# Altium schematic sheet TDC_cern.SchDoc: FMC_ADC
size 420 x 297 mm; Author: G.Kasprowicz; CompanyName: WUT ISE; DrawnBy: G.Kasprowicz; Organization: WUT ISE; Address1: PW ISE; Address2: Nowowiejska 15/19 00-665 Warsaw; Address3: gkasprow@gmail.com; DocumentNumber: 4; Revision: 2; SheetNumber: 4; SheetTotal: 12; ModifiedBy: -; CheckedDate: -; Title2: quad TDC; DivGrp: WUT ISE; Designer: G.Kasprowicz; ModifiedDate: -; ProjectName: Sensor Box
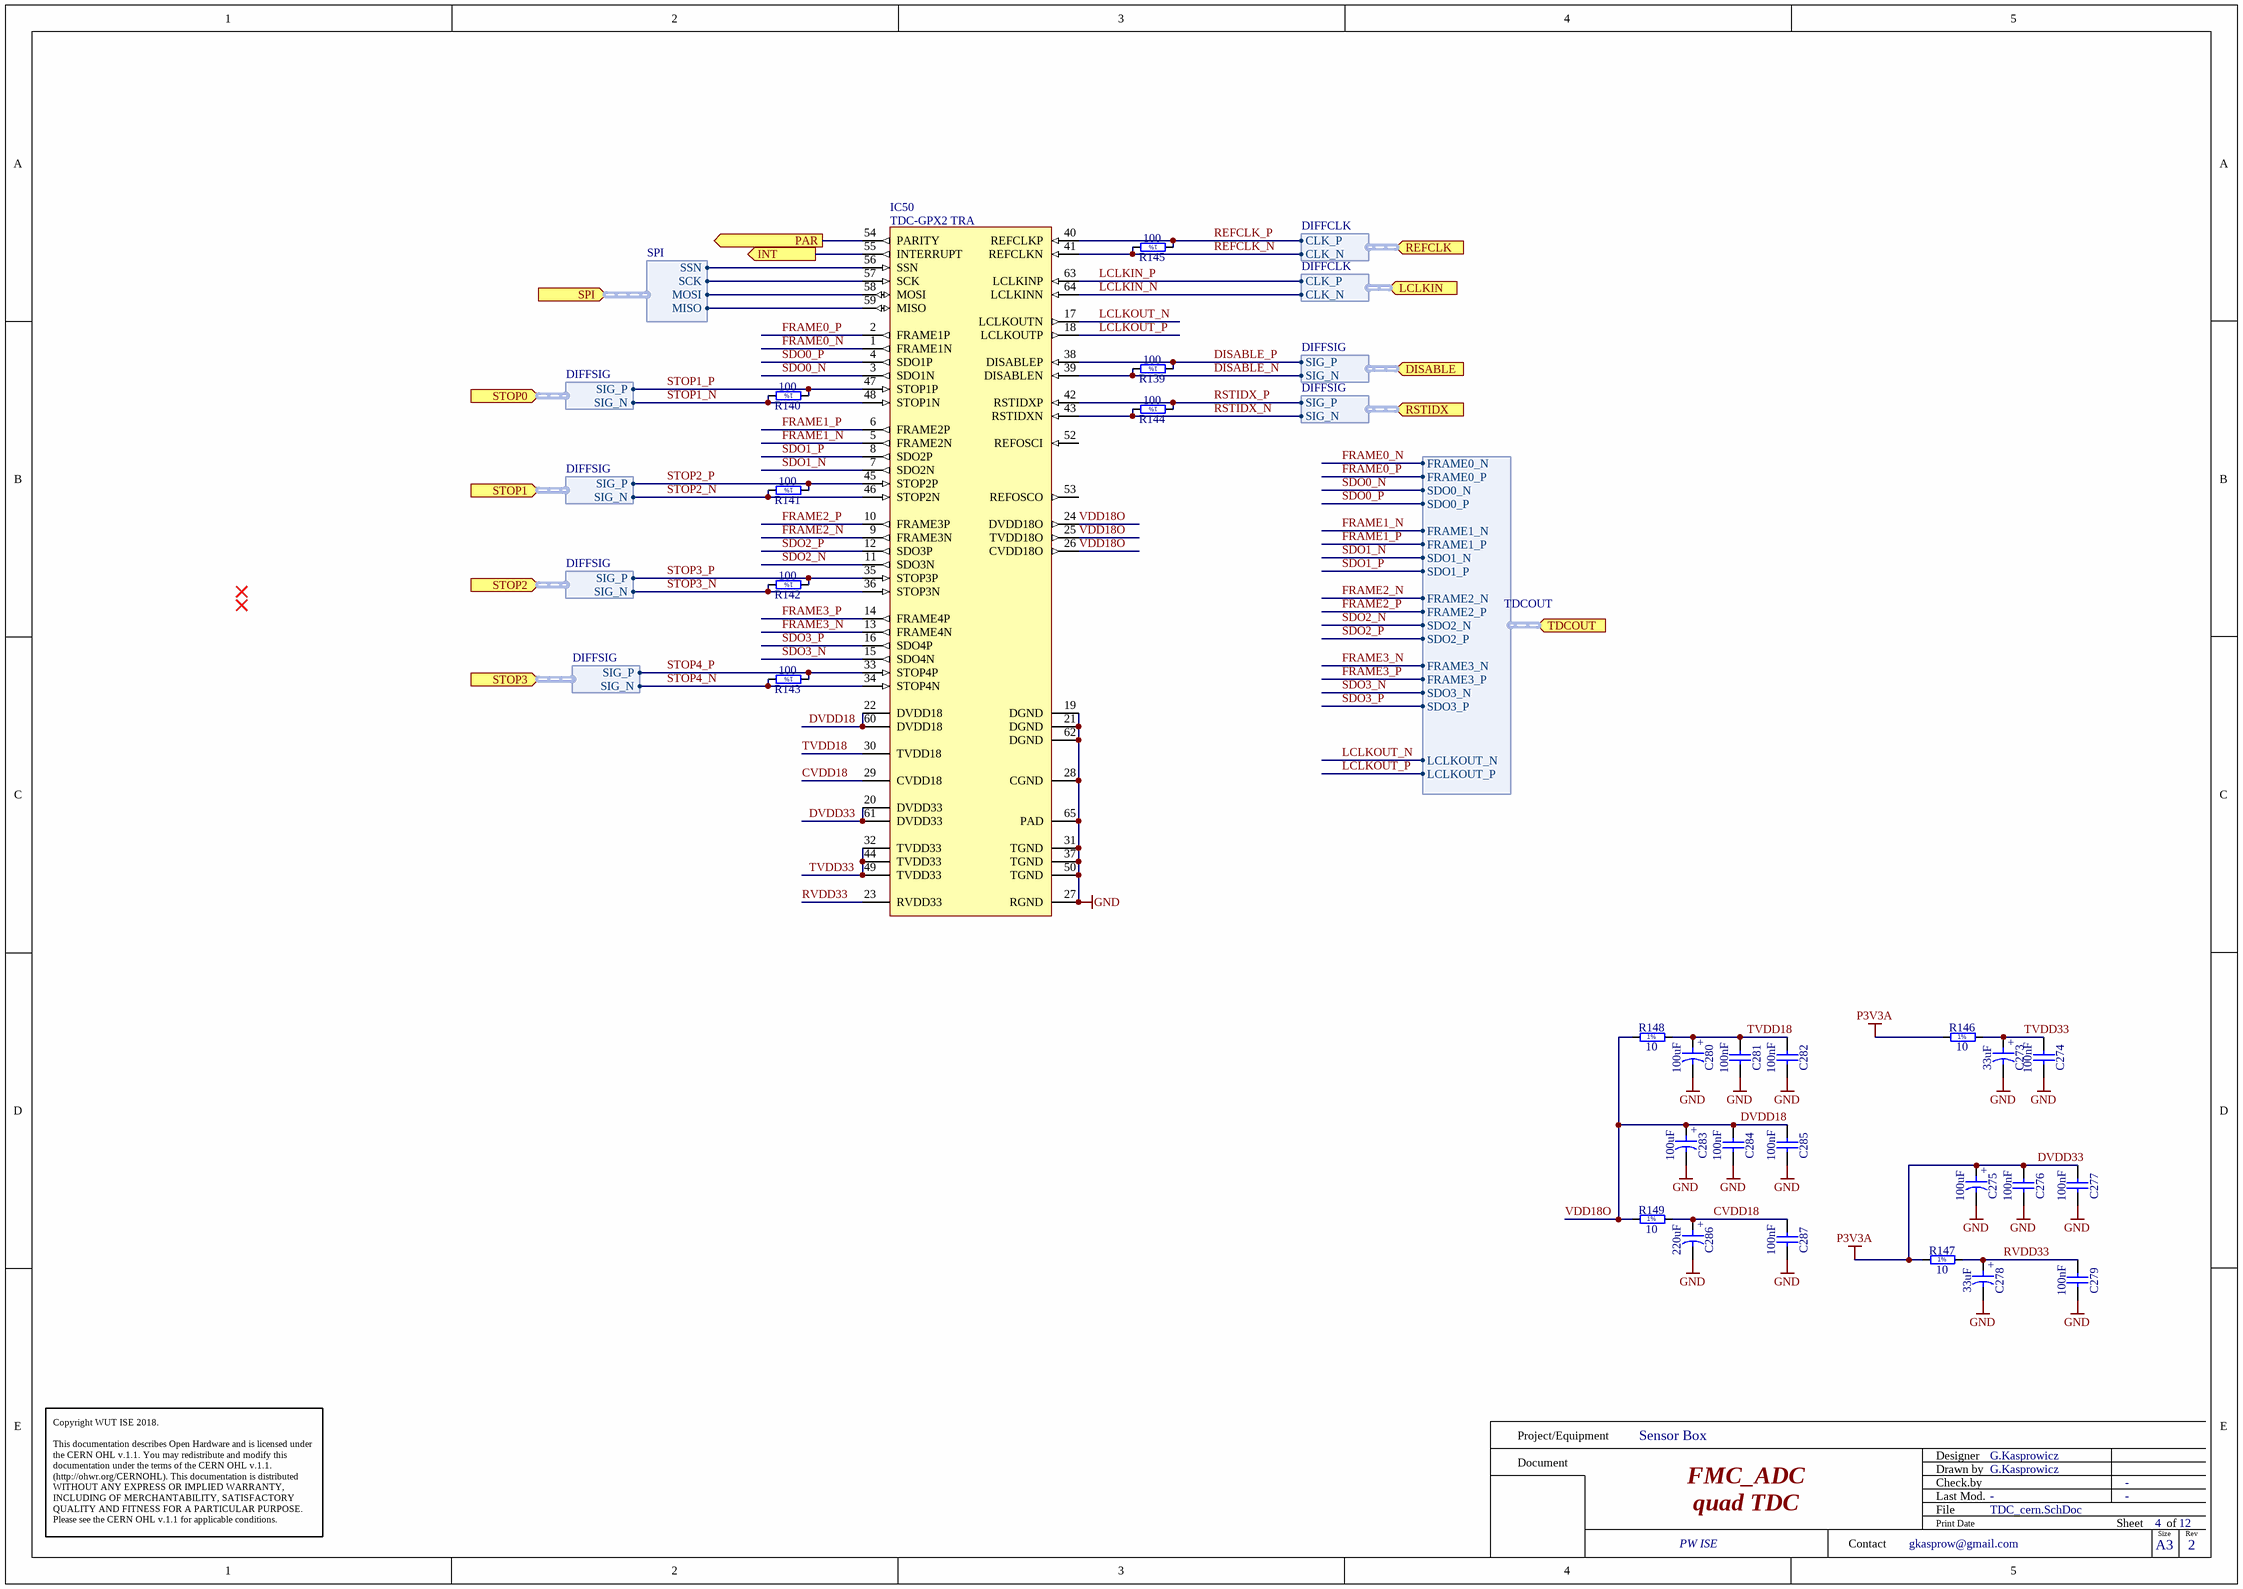
[diagram p0: TDC_cern.SchDoc]

## Parts
C273  33uF  [CAPMP3216X180N]
C274  100nF  [CAPC0603X33N]
C275  100uF  [CAPMP3216X180N]
C276  100nF  [CAPC0603X33N]
C277  100nF  [CAPC0603X33N]
C278  33uF  [CAPMP3216X180N]
C279  100nF  [CAPC0603X33N]
C280  100uF  [CAPMP3216X180N]
C281  100nF  [CAPC0603X33N]
C282  100nF  [CAPC0603X33N]
C283  100uF  [CAPMP3216X180N]
C284  100nF  [CAPC0603X33N]
C285  100nF  [CAPC0603X33N]
C286  220uF  [CAPMP3528X210N]
C287  100nF  [CAPC0603X33N]
IC50  TDC-GPX2 TRA  [QFN50P900X900X100-65N-S615]
R139  100  [RESC0603X28N]
R140  100  [RESC0603X28N]
R141  100  [RESC0603X28N]
R142  100  [RESC0603X28N]
R143  100  [RESC0603X28N]
R144  100  [RESC0603X28N]
R145  100  [RESC0603X28N]
R146  10  [RESC1005X40N]
R147  10  [RESC1005X40N]
R148  10  [RESC1005X40N]
R149  10  [RESC1005X40N]

## Ports
DISABLE (in, harness DIFFSIG), INT (out), LCLKIN (in, harness DIFFCLK), PAR (out), REFCLK (in, harness DIFFCLK), RSTIDX (in, harness DIFFSIG), SPI (in, harness SPI), STOP0 (in, harness DIFFSIG), STOP1 (in, harness DIFFSIG), STOP2 (in, harness DIFFSIG), STOP3 (in, harness DIFFSIG), TDCOUT (in, harness TDCOUT)

## Harnesses
TDCOUT: FRAME0_N, FRAME0_P, SDO0_N, SDO0_P, FRAME1_N, FRAME1_P, SDO1_N, SDO1_P, FRAME2_N, FRAME2_P, SDO2_N, SDO2_P, FRAME3_N, FRAME3_P, SDO3_N, SDO3_P, LCLKOUT_N, LCLKOUT_P
SPI: MISO, MOSI, SCK, SSN
DIFFSIG: SIG_P, SIG_N
DIFFCLK: CLK_P, CLK_N

## Nets
DVDD33: C275.1 C276.1 C277.1 IC50.20(DVDD33) IC50.61(DVDD33) R146.1 R147.1  [also labelled P3V3A]
GND: C273.2 C274.2 C275.2 C276.2 C277.2 C278.2 C279.2 C280.2 C281.2 C282.2 C283.2 C284.2 C285.2 C286.2 C287.2 IC50.19(DGND) IC50.21(DGND) IC50.27(RGND) IC50.28(CGND) IC50.31(TGND) IC50.37(TGND) IC50.50(TGND) IC50.62(DGND) IC50.65(PAD)
CVDD18: C286.1 C287.1 IC50.29(CVDD18) R149.2
DISABLE_N: IC50.39(DISABLEN) R139.2 ; port DISABLE.SIG_N
DISABLE_P: IC50.38(DISABLEP) R139.1 ; port DISABLE.SIG_P
DVDD18: C283.1 C284.1 C285.1 IC50.22(DVDD18) IC50.24(DVDD18O) IC50.25(TVDD18O) IC50.26(CVDD18O) IC50.60(DVDD18) R148.1 R149.1  [also labelled VDD18O]
FRAME0_N: IC50.1(FRAME1N) ; port TDCOUT.FRAME0_N
FRAME0_P: IC50.2(FRAME1P) ; port TDCOUT.FRAME0_P
FRAME1_N: IC50.5(FRAME2N) ; port TDCOUT.FRAME1_N
FRAME1_P: IC50.6(FRAME2P) ; port TDCOUT.FRAME1_P
FRAME2_N: IC50.9(FRAME3N) ; port TDCOUT.FRAME2_N
FRAME2_P: IC50.10(FRAME3P) ; port TDCOUT.FRAME2_P
FRAME3_N: IC50.13(FRAME4N) ; port TDCOUT.FRAME3_N
FRAME3_P: IC50.14(FRAME4P) ; port TDCOUT.FRAME3_P
INT: IC50.55(INTERRUPT) ; port INT
LCLKIN_N: IC50.64(LCLKINN) ; port LCLKIN.CLK_N
LCLKIN_P: IC50.63(LCLKINP) ; port LCLKIN.CLK_P
LCLKOUT_N: IC50.17(LCLKOUTN) ; port TDCOUT.LCLKOUT_N
LCLKOUT_P: IC50.18(LCLKOUTP) ; port TDCOUT.LCLKOUT_P
PAR: IC50.54(PARITY) ; port PAR
REFCLK_N: IC50.41(REFCLKN) R145.2 ; port REFCLK.CLK_N
REFCLK_P: IC50.40(REFCLKP) R145.1 ; port REFCLK.CLK_P
RSTIDX_N: IC50.43(RSTIDXN) R144.2 ; port RSTIDX.SIG_N
RSTIDX_P: IC50.42(RSTIDXP) R144.1 ; port RSTIDX.SIG_P
RVDD33: C278.1 C279.1 IC50.23(RVDD33) R147.2
SDO0_N: IC50.3(SDO1N) ; port TDCOUT.SDO0_N
SDO0_P: IC50.4(SDO1P) ; port TDCOUT.SDO0_P
SDO1_N: IC50.7(SDO2N) ; port TDCOUT.SDO1_N
SDO1_P: IC50.8(SDO2P) ; port TDCOUT.SDO1_P
SDO2_N: IC50.11(SDO3N) ; port TDCOUT.SDO2_N
SDO2_P: IC50.12(SDO3P) ; port TDCOUT.SDO2_P
SDO3_N: IC50.15(SDO4N) ; port TDCOUT.SDO3_N
SDO3_P: IC50.16(SDO4P) ; port TDCOUT.SDO3_P
STOP1_N: IC50.48(STOP1N) R140.2 ; port STOP0.SIG_N
STOP1_P: IC50.47(STOP1P) R140.1 ; port STOP0.SIG_P
STOP2_N: IC50.46(STOP2N) R141.2 ; port STOP1.SIG_N
STOP2_P: IC50.45(STOP2P) R141.1 ; port STOP1.SIG_P
STOP3_N: IC50.36(STOP3N) R142.2 ; port STOP2.SIG_N
STOP3_P: IC50.35(STOP3P) R142.1 ; port STOP2.SIG_P
STOP4_N: IC50.34(STOP4N) R143.2 ; port STOP3.SIG_N
STOP4_P: IC50.33(STOP4P) R143.1 ; port STOP3.SIG_P
TVDD18: C280.1 C281.1 C282.1 IC50.30(TVDD18) R148.2
TVDD33: C273.1 C274.1 IC50.32(TVDD33) IC50.44(TVDD33) IC50.49(TVDD33) R146.2
NetIC50_56: IC50.56(SSN) ; port SPI.SSN
NetIC50_57: IC50.57(SCK) ; port SPI.SCK
NetIC50_58: IC50.58(MOSI) ; port SPI.MOSI
NetIC50_59: IC50.59(MISO) ; port SPI.MISO

Not connected (* = marked no-connect by the designer): IC50 52(REFOSCI) 53(REFOSCO)

## Notes on the sheet
- Project/Equipment
- Document
- Designer
- Drawn by
- Check.by
- Copyright WUT ISE 2018.
  This documentation describes Open Hardware and is licensed under the CERN OHL v.1.1. You may redistribute and modify this documentation under the terms of the CERN OHL v.1.1. (http://ohwr.org/CERNOHL). This documentation is distributed WITHOUT ANY EXPRESS OR IMPLIED WARRANTY, INCLUDING OF MERCHANTABILITY, SATISFACTORY QUALITY AND FITNESS FOR A PARTICULAR PURPOSE. Please see the CERN OHL v.1.1 for applicable conditions.
- Contact
- File
- Last Mod.
- Print Date
- Sheet
- Size
- A3
- of
- Rev
- (in symbol CTE3216-18_33UF_4V_10%) +
- (in symbol CTE3216-18_100UF_6.3V_20%_ESR0500_AVX_TLJ) +
- (in symbol CTE3528-21_220UF_2.5V_10%) +
- (in symbol R0201_100R_1%_0.05W_200PPM) 1%
- (in symbol R0402_10R_1%_0.0625W_200PPM) 1%

## Library data of the parts
C273 C278 = CTE3216-18_33UF_4V_10%: Polarised capacitor; Part Description: Solid Tantalum Chip Capacitor; Manufacturer: GENERIC; Manufacturer1 Part Number: TAJA336K004R; Voltage: 4V; Tolerance: ±10%; Part Number: CTE3216-18_33UF_4V_10%; Component Kind: Standard; Component Type: Standard; Pin Count: 2; Value: 33uF; Status: Preferred; Manufacturer Part Number: CTE3216-18_33UF_4V_10%; Case: A; Mounted: Yes; Socket: No; SMD: Yes; Sense: No; Manufacturer1 Example: AVX; Manufacturer1 ComponentHeight: 1.8mm; HelpURL: \\cern.ch\dfs\Applications\Altium\Datasheets\CTE_AVX_TAJ.pdf; Author: CERN DEM JLC; CreateDate: 03.12.2007; LatestRevisionDate: 03.12.2007
C274 C276 C279 C281 C282 C284 C287 = CC0201_100NF_6.3V_10%_X5R: Non-polarised capacitor; Part Description: SMD Multilayer Chip Ceramic Capacitor; Manufacturer: GENERIC; Manufacturer1 Part Number: 02016D104KAT2A; Voltage: 6.3V; TC: X5R; Tolerance: ±10%; Part Number: CC0201_100NF_6.3V_10%_X5R; Component Kind: Standard; Component Type: Standard; Pin Count: 2; Value: 100nF; Status: Not Recommended; Manufacturer Part Number: CC0201_100NF_6.3V_10%_X5R; Case: 0201; Mounted: Yes; Socket: No; SMD: Yes; Sense: No; Manufacturer1 Example: AVX; Manufacturer1 ComponentHeight: 0.33mm; HelpURL: \\cern.ch\dfs\Applications\Altium\Datasheets\CC0201_X5R_AVX.pdf; Author: CERN DEM JLC; CreateDate: 03.12.2007; LatestRevisionDate: 03.12.2007
C275 C280 C283 = CTE3216-18_100UF_6.3V_20%_ESR0500_AVX_TLJ: Polarised capacitor; Part Description: ESR 0R5 Solid Tantalum Chip Capacitor; Manufacturer: AVX; Manufacturer Part Number: TLJA107M006R0500; Voltage: 6.3V; Tolerance: ±20%; Part Number: CTE3216-18_100UF_6.3V_20%_ESR0500_AVX_TLJ; Component Kind: Standard; Component Type: Standard; Pin Count: 2; Value: 100uF; Status: None; Case: A; Mounted: Yes; Socket: No; SMD: Yes; Sense: No; HelpURL: \\cern.ch\dfs\Applications\Altium\Datasheets\CTE_AVX_TLJ.pdf; Author: CERN DEM JLC; CreateDate: 19.12.2013; LatestRevisionDate: 19.12.2013; ComponentHeight: 1.8mm
C277 C285 = CC0201_100NF_6.3V_10%_X5R: Non-polarised capacitor; Part Description: SMD Multilayer Chip Ceramic Capacitor; Manufacturer: GENERIC; Manufacturer1 Part Number: 02016D104KAT2A; Voltage: 6.3V; Tolerance: ±10%; TC: X5R; Part Number: CC0201_100NF_6.3V_10%_X5R; Component Kind: Standard; Component Type: Standard; Pin Count: 2; Value: 100nF; Status: Not Recommended; Manufacturer Part Number: CC0201_100NF_6.3V_10%_X5R; Case: 0201; Mounted: Yes; Socket: No; SMD: Yes; Sense: No; Manufacturer1 Example: AVX; Manufacturer1 ComponentHeight: 0.33mm; HelpURL: \\cern.ch\dfs\Applications\Altium\Datasheets\CC0201_X5R_AVX.pdf; Author: CERN DEM JLC; CreateDate: 03.12.2007; LatestRevisionDate: 03.12.2007
C286 = CTE3528-21_220UF_2.5V_10%: Polarised capacitor; Part Description: Solid Tantalum Chip Capacitor; Manufacturer: GENERIC; Manufacturer1 Part Number: TAJB227K002R; Voltage: 2.5V; Tolerance: ±10%; Part Number: CTE3528-21_220UF_2.5V_10%; Component Kind: Standard; Component Type: Standard; Pin Count: 2; Value: 220uF; Status: Preferred; Manufacturer Part Number: CTE3528-21_220UF_2.5V_10%; Case: B; Mounted: Yes; Socket: No; SMD: Yes; Sense: No; Manufacturer1 Example: AVX; Manufacturer1 ComponentHeight: 2.1mm; HelpURL: \\cern.ch\dfs\Applications\Altium\Datasheets\CTE_AVX_TAJ.pdf; Author: CERN DEM JLC; CreateDate: 03.12.2007; LatestRevisionDate: 03.12.2007
IC50 = TDC-GPX2_QFN: 4 Channel Time to Digital Converter; Manufacturer: AMS; PressFit: No; Bonding: No; Part Number: TDC-GPX2 TRA; Component Kind: Standard; Component Type: Standard; Device: TDC-GPX2 TRA; Footprint: QFP50P1200X1200X160-64N; PackageDescription: QFP, 0.50mm Pitch, Square; 64 Pin, 10.0mm L X 10.0mm W X 1.60mm H Body, IPC Medium Density; Part Description: 4 Channel Time to Digital Converter; Manufacturer Part Number: TDC-GPX2 TRA; Pin Count: 64; Case: QFP64; Mounted: Yes; Socket: No; SMD: Yes; Sense: No; ComponentHeight: 1.6mm; Author: GK; HelpURL: \\cern.ch\dfs\Applications\Altium\Datasheets\AMS_TDC-GPX2.pdf; CreateDate: 23.04.2019; LatestRevisionDate: 23.04.2019
R139-R145 = R0201_100R_1%_0.05W_200PPM: Resistor - 1%; Part Description: Thick Film Chip Resistor; Manufacturer: GENERIC; Manufacturer1 Part Number: CRCW0201100RFNED; Power: 0.05W; TC: ±200ppm/°C; PressFit: No; Part Number: R0201_100R_1%_0.05W_200PPM; Component Kind: Standard; Component Type: Standard; Pin Count: 2; Value: 100; Status: Not Recommended; Tolerance: ±1%; Manufacturer Part Number: R0201_100R_1%_0.05W_200PPM; Case: 0201; Mounted: Yes; Sense: No; Socket: No; SMD: Yes; Manufacturer1 Example: VISHAY; Manufacturer1 ComponentHeight: 0.27mm; HelpURL: \\cern.ch\dfs\Applications\Altium\Datasheets\R0201_VISHAY_CRCW0201 e3.pdf; Author: CERN DEM JLC; CreateDate: 13.11.2014; LatestRevisionDate: 13.11.2014
R146-R149 = R0402_10R_1%_0.0625W_200PPM: Resistor - 1%; Part Description: General Purpose Thick Film Chip Resistor; Manufacturer: GENERIC; Manufacturer1 Part Number: 232270671009L; TC: ±200ppm/°C; PressFit: No; Part Number: R0402_10R_1%_0.0625W_200PPM; Component Kind: Standard; Component Type: Standard; Pin Count: 2; Value: 10; Status: Not Recommended; Power: 0.0625W; Tolerance: ±1%; Manufacturer Part Number: R0402_10R_1%_0.0625W_200PPM; Case: 0402; Mounted: Yes; Sense: No; Socket: No; SMD: Yes; Manufacturer1 Example: YAGEO PHYCOMP; Manufacturer1 ComponentHeight: 0.4mm; HelpURL: \\cern.ch\dfs\Applications\Altium\Datasheets\R0402_Phycomp_RC0402.pdf; Author: CERN DEM JLC; CreateDate: 24.06.2009; LatestRevisionDate: 17.10.2012